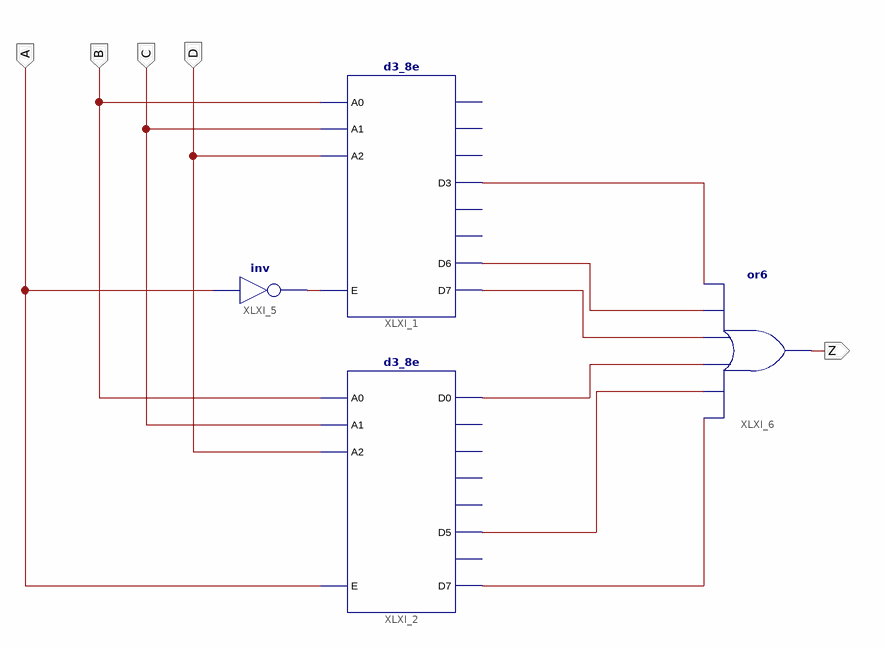
[diagram p0: schematic sheet 1]
// Xilinx ISE schematic p2ej2.sch (spartan3) as structural Verilog: 4 symbols, 5 ports
module p2ej2 (
  input  C,
  input  D,
  input  B,
  input  A,
  output Z
);

  wire XLXN_20, XLXN_23, XLXN_24, XLXN_25, XLXN_26, XLXN_27, XLXN_28;

  d3_8e XLXI_1 (
    .A0(B), .A1(C), .A2(D), .E(XLXN_20), .D3(XLXN_23), .D6(XLXN_24), .D7(XLXN_25));  // open: D0, D1, D2, D4, D5
  d3_8e XLXI_2 (.A0(B), .A1(C), .A2(D), .E(A), .D0(XLXN_26), .D5(XLXN_28), .D7(XLXN_27));  // open: D1, D2, D3, D4, D6
  not XLXI_5 (XLXN_20, A);
  or XLXI_6 (Z, XLXN_27, XLXN_28, XLXN_26, XLXN_25, XLXN_24, XLXN_23);
endmodule
